# Altium schematic sheet Connectors.SchDoc
size A4; Organization: Altium Limited; Address1: L3, 12a Rodborough Rd; Address2: Frenchs Forest; Address3: NSW; Address4: Australia 2086
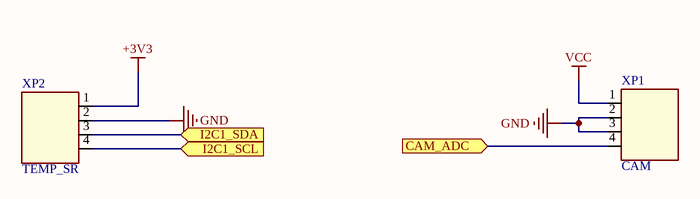
[diagram p0: Connectors.SchDoc]

## Parts
XP1  CAM  [HEAD-SMD-2.54/4]
XP2  TEMP_SR  [HEAD-SMD-2.54/4]

## Ports
CAM_ADC (in), I2C1_SCL (in), I2C1_SDA (in)

## Nets
+3V3: XP2.1
GND: XP1.2 XP1.3 XP2.2
VCC: XP1.1
CAM_ADC: XP1.4 ; port CAM_ADC
I2C1_SCL: XP2.4 ; port I2C1_SCL
I2C1_SDA: XP2.3 ; port I2C1_SDA

## Notes on the sheet
- Title
- Size:
- Date:
- A4
- Number:
- Time:
- Revision:
- Sheet
- of
- File:

## Library data of the parts
XP1 XP2 = CON_4